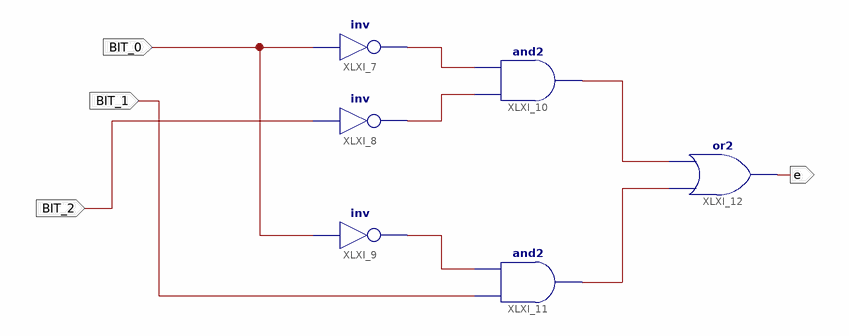
[diagram p0: schematic sheet 1]
// Xilinx ISE schematic SEG_E.sch (spartan6) as structural Verilog: 6 symbols, 4 ports
module SEG_E (
  input  BIT_0,
  input  BIT_1,
  input  BIT_2,
  output e
);

  wire XLXN_14, XLXN_15, XLXN_16, XLXN_19, XLXN_20;

  not XLXI_7 (XLXN_16, BIT_0);
  not XLXI_8 (XLXN_19, BIT_2);
  not XLXI_9 (XLXN_20, BIT_0);
  and XLXI_10 (XLXN_14, XLXN_19, XLXN_16);
  and XLXI_11 (XLXN_15, BIT_1, XLXN_20);
  or XLXI_12 (e, XLXN_15, XLXN_14);
endmodule
